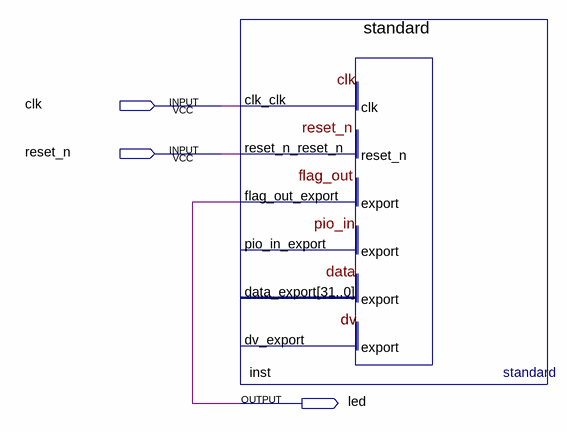
[diagram p0: schematic sheet]
// Quartus schematic iir-nios.bdf as structural Verilog: 1 symbols, 3 pins
module \iir-nios  (
  input  clk,
  input  reset_n,
  output led
);

  standard inst (
    .clk_clk(clk), .reset_n_reset_n(reset_n), .flag_out_export(led));  // open: pio_in_export, data_export, dv_export
endmodule
